# EAGLE design NCV7702B-2 (EAGLE 5.06)
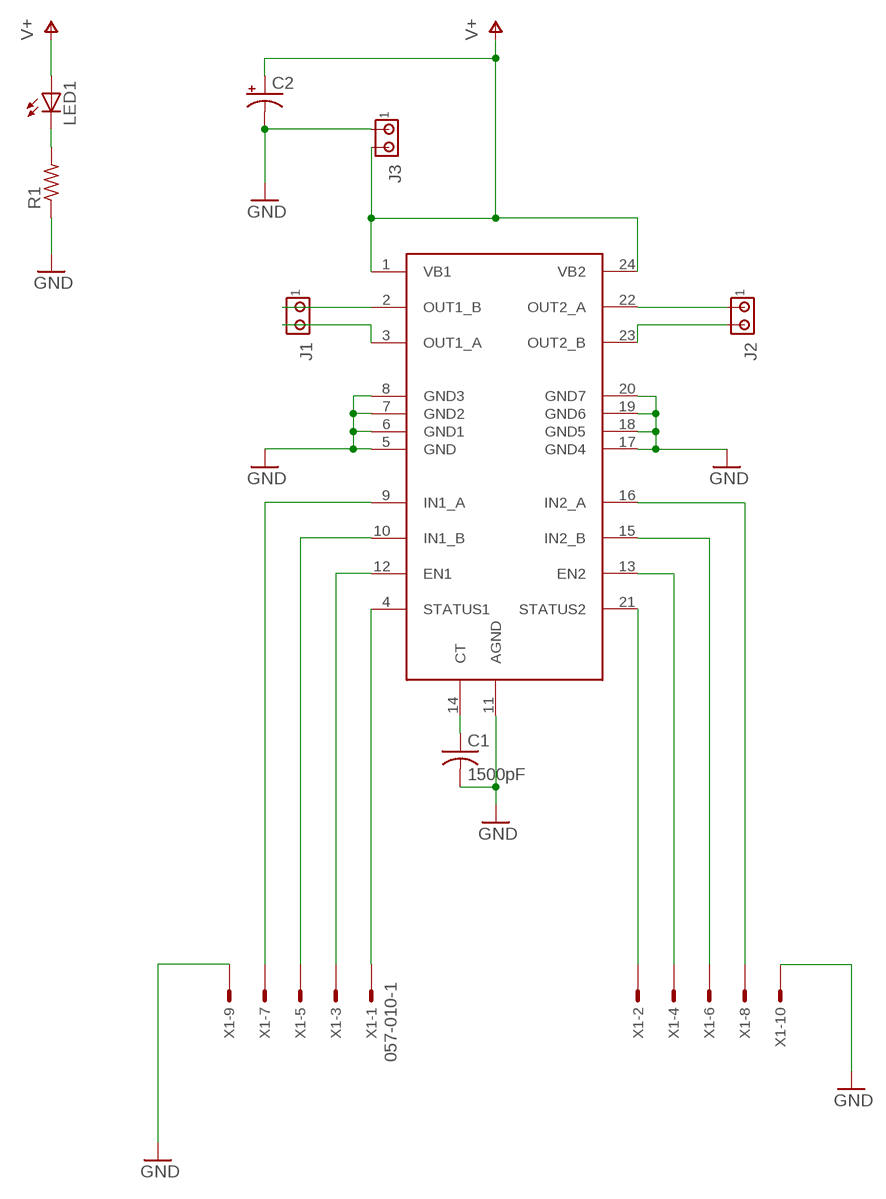
[diagram p0: schematic, sheet 1]

## Parts
C1  1500pF  C-US050-025X075  [C050-025X075]
C2  CPOL-USE5-10.5  [E5-10,5]
IC1  7702  [SO24W]
J1  MTA02-156  [1X2MTA]
J2  MTA02-156  [1X2MTA]
J3  MTA02-156  [1X2MTA]
LED1  LEDSMT1206  [1206]
R1  R-US_M1206  [M1206]
X1  057-010-1  [057-010-1]

## Nets
GND: C1.2 C2.- IC1.5(GND) IC1.6(GND1) IC1.7(GND2) IC1.8(GND3) IC1.11(AGND) IC1.17(GND4) IC1.18(GND5) IC1.19(GND6) IC1.20(GND7) J3.1 R1.1 X1.9 X1.10
N$1: IC1.2(OUT1_B) J1.1
N$2: IC1.10(IN1_B) X1.5
N$3: IC1.9(IN1_A) X1.7
N$4: IC1.13(EN2) X1.4
N$5: IC1.15(IN2_B) X1.6
N$6: IC1.3(OUT1_A) J1.2
N$7: IC1.22(OUT2_A) J2.1
N$8: IC1.23(OUT2_B) J2.2
N$9: IC1.16(IN2_A) X1.8
N$10: LED1.C R1.2
N$11: IC1.12(EN1) X1.3
N$12: IC1.4(STATUS1) X1.1
N$15: IC1.21(STATUS2) X1.2
N$17: C1.1 IC1.14(CT)
V+: C2.+ IC1.1(VB1) IC1.24(VB2) J3.2 LED1.A

## Library data of the parts
C1 = rcl:C-US: CAPACITOR, American symbol
C2 = rcl:CPOL-US: POLARIZED CAPACITOR, American symbol
IC1 = A-JD:7702
J1-J3 = con-amp:MTA02-156: AMP connector
LED1 = led:LED: LED OSRAM: - CHIPLED LG R971, LG N971, LY N971, LG Q971, LY Q971, LO R971, LY R971 LH N974, LH R974 LS Q976, LO Q976, LY Q976 LO Q996 - Hyper CHIPLED LW Q18S LB Q993, LB Q99A, LB R99A - SideLED LS A670, LO A670, LY A670, LG A670, LP A670 LB A673, LV A673, LT A673, LW A673 LH A674 LY A675 LS A676, LA A676, LO A676, LY A676, LW A676 LS A679, LY A679, LG A679 - Hyper Micro SIDELED® LS Y876, LA Y876, LO Y876, LY Y876 LT Y87S - SmartLED LW L88C, LW L88S LB L89C, LB L89S, LG L890 LS L89K, LO L89K, LY L89K LS L896, LA L896, LO L896, LY L896 - TOPLED LS T670, LO T670, LY T670, LG T670, LP T670 LSG T670, LSP T670, LSY T670, LOP T670, LYG T670 LG T671, LOG T671, LSG T671 LB T673, LV T673, LT T673, LW T673 LH T674 LS T676, LA T676, LO T676, LY T676, LB T676, LH T676, LSB T676, LW T676 LB T67C, LV T67C, LT T67C, LS T67K, LO T67K, LY T67K, LW E67C LS E67B, LA E67B, LO E67B, LY E67B, LB E67C, LV E67C, LT E67C LW T67C LS T679, LY T679, LG T679 LS T770, LO T770, LY T770, LG T770, LP T770 LB T773, LV T773, LT T773, LW T773 LH T774 LS E675, LA E675, LY E675, LS T675 LS T776, LA T776, LO T776, LY T776, LB T776 LHGB T686 LT T68C, LB T68C - Hyper Mini TOPLED® LB M676 - Mini TOPLED Santana® LG M470 LS M47K, LO M47K, LY M47K Source: http://www.osram.convergy.de LUXEON: - LUMILED® LXK2-PW12-R00, LXK2-PW12-S00, LXK2-PW14-U00, LXK2-PW14-V00 LXK2-PM12-R00, LXK2-PM12-S00, LXK2-PM14-U00 LXK2-PE12-Q00, LXK2-PE12-R00, LXK2-PE12-S00, LXK2-PE14-T00, LXK2-PE14-U00 LXK2-PB12-K00, LXK2-PB12-L00, LXK2-PB12-M00, LXK2-PB14-N00, LXK2-PB14-P00, LXK2-PB14-Q00 LXK2-PR12-L00, LXK2-PR12-M00, LXK2-PR14-Q00, LXK2-PR14-R00 LXK2-PD12-Q00, LXK2-PD12-R00, LXK2-PD12-S00 LXK2-PH12-R00, LXK2-PH12-S00 LXK2-PL12-P00, LXK2-PL12-Q00, LXK2-PL12-R00 Source: www.luxeon.com KINGBRIGHT: KA-3528ASYC Source: www.kingbright.com
R1 = resistor:R-US_: RESISTOR, American symbol
X1 = con-panduit:057-010-: CONNECTOR 10-pin series 057 contact pc board low profile headers

## Board
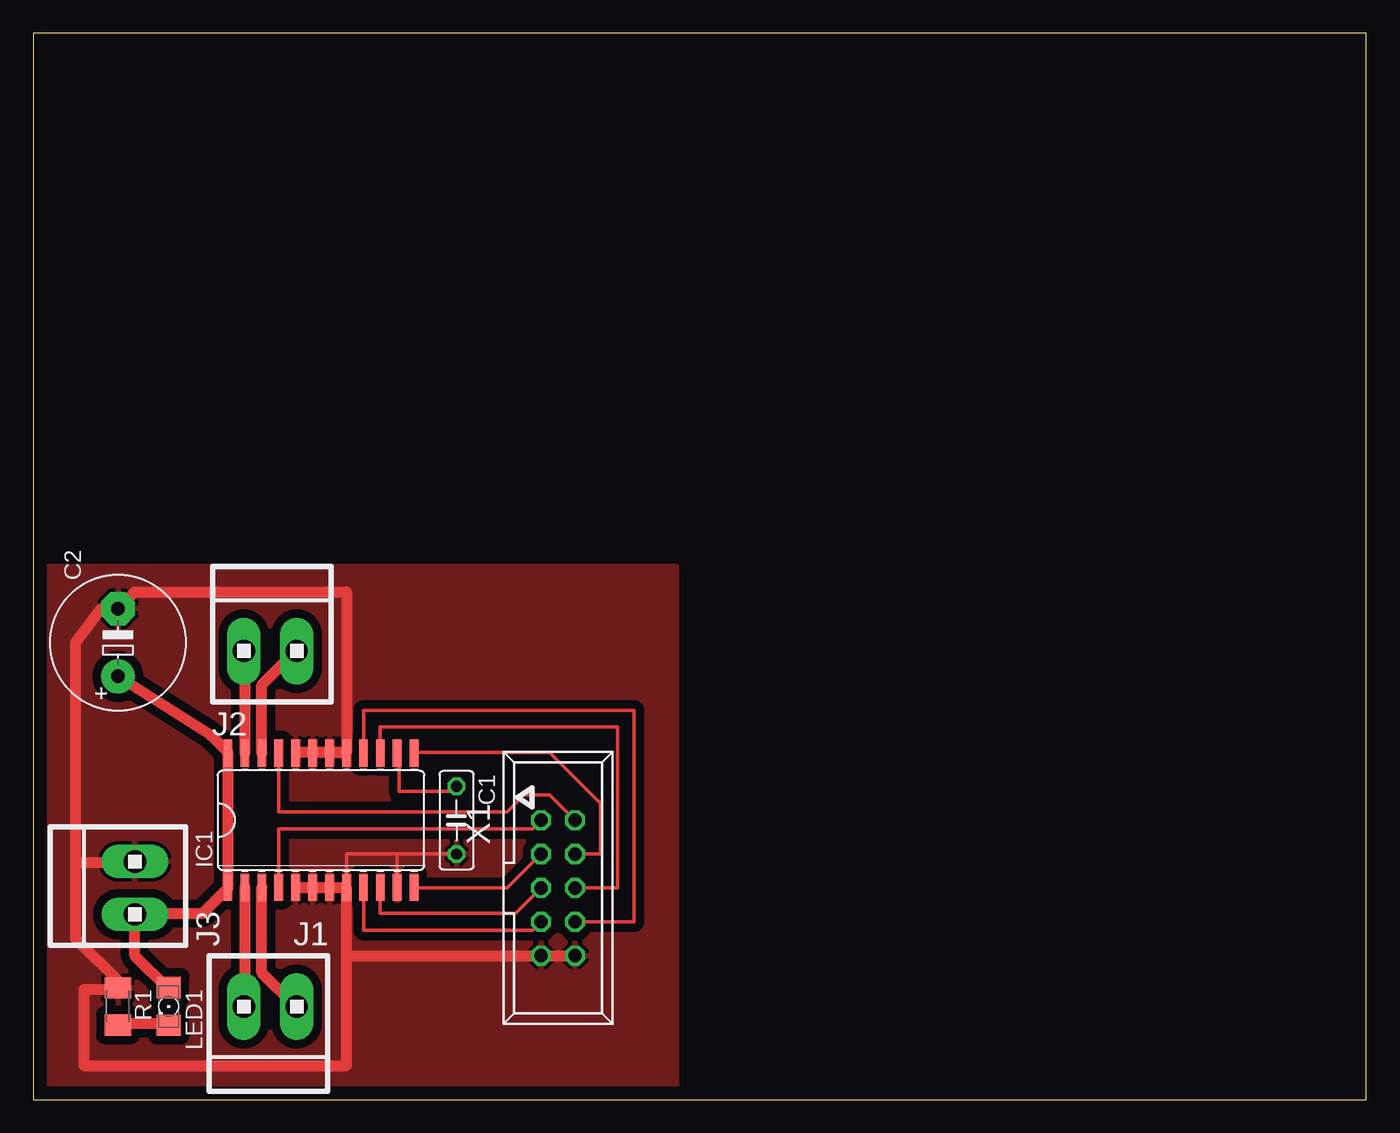
[diagram p1: board, top side]

Size 100 x 80 mm. Coordinates in mm from the lower left corner, seen from the top.
Outline: 0,0 100,0 100,80 0,80 0,0
Copper layers (1*16): Top 0.035mm / dielectric 1.5mm / Bottom 0.035mm
Design rules "default *": minimum track width 10mil, minimum drill 24mil, track to track 25mil, track to pad 25mil, pad to pad 8mil, via to via 8mil, smd to smd 8mil, copper to edge 40mil, drill to drill 8mil, minimum pad ring 10mil, minimum via ring 8mil, stop-mask expansion 4mil, vias tented up to drill 0mil, thermal gap 10mil

### Footprints (pad centres in the part's own frame; a part is rotated, then mirrored left to right if it is on the bottom)
C050-025X075 = drill 0.813 octagon: 1 -2.54,0; 2 2.54,0
E5-10,5 = drill 1.016 pad 2.54 round: + -2.54,0 | drill 1.016 pad 2.54 octagon: - 2.54,0
SO24W = smd 0.66 x 2.032: 1 -6.985,-5.029; 2 -5.715,-5.029; 3 -4.445,-5.029; 4 -3.175,-5.029; 5 -1.905,-5.029; 6 -0.635,-5.029; 7 0.635,-5.029; 8 1.905,-5.029; 9 3.175,-5.029; 10 4.445,-5.029; 11 5.715,-5.029; 12 6.985,-5.029; 13 6.985,5.029; 14 5.715,5.029; 15 4.445,5.029; 16 3.175,5.029; 17 1.905,5.029; 18 0.635,5.029; 19 -0.635,5.029; 20 -1.905,5.029; 21 -3.175,5.029; 22 -4.445,5.029; 23 -5.715,5.029; 24 -6.985,5.029
1X2MTA = drill 1.676 long: 1 1.981,0; 2 -1.981,0
1206 = smd 1.6 x 1.803: A -1.422,0; C 1.422,0
M1206 = smd 1.6 x 2: 1 -1.4,0; 2 1.4,0
057-010-1 = drill 1 octagon: 1 -5.08,-1.27; 2 -5.08,1.27; 3 -2.54,-1.27; 4 -2.54,1.27; 5 0,-1.27; 6 0,1.27; 7 2.54,-1.27; 8 2.54,1.27; 9 5.08,-1.27; 10 5.08,1.27

### Placement (x,y rotation side)
C1  31.75,20.95 270 top
C2  6.35,34.29 90 top
IC1  21.59,20.95 0 top
J1  17.78,6.99 180 top
J2  17.78,33.66 0 top
J3  7.62,15.88 90 top
LED1  10.16,6.99 270 top
R1  6.35,6.99 270 top
X1  39.37,15.88 270 top

### Tracks (layer width: path | path; a pad name or v marks a point on that pad's centre or on a via)
GND
  Top 0.254: 39.37,10.79 X1.9 | 19.81,26.04 IC1.20 19.81,25.78 | 20.83,26.04 IC1.19 21.08,26.04 | 23.37,26.04 IC1.17 | 21.59,26.04 22.1,26.04 IC1.18 | 19.81,15.88 IC1.5 19.81,16.13 | IC1.6 20.83,15.88 | IC1.7 22.35,15.88 23.37,15.88 IC1.8 23.5,17.14 | 22.1,15.88 23.5,15.88 23.5,17.14 | 27.3,18.41 C1.2 23.5,18.41 | 23.5,18.41 27.3,18.41 | 27.3,18.41 IC1.11 | 23.5,17.14 23.5,18.41 | 6.35,8.89 R1.1 6.35,8.26 | 7.62,17.78 J3.1
  Top 0.813: X1.10 39.37,10.79 23.5,10.79 | 20.83,26.04 19.81,26.04 | 23.37,26.04 22.35,26.04 IC1.18 | 21.08,26.04 21.59,26.04 23.5,26.04 23.5,38.1 7.62,38.1 C2.- 5.08,36.83 3.17,34.29 3.17,17.78 | 20.83,15.88 19.81,15.88 | IC1.6 21.08,15.88 23.5,15.88 23.5,10.79 | 22.1,15.88 IC1.7 | 6.35,8.89 3.17,12.06 3.17,17.78 | 3.17,17.78 7.62,17.78 | 23.5,10.79 23.5,2.54 3.81,2.54 3.81,8.26 6.35,8.26
  pour Top: 0.64,40.01 48.26,40.01 48.26,0.64 0.64,0.64
N$1
  Top 0.254: J1.1 15.88,6.99
  Top 0.813: 15.88,6.99 IC1.2
N$2
  Top 0.254: IC1.10 26.04,13.97 36.2,13.97 X1.5
N$3
  Top 0.254: IC1.9 24.77,12.7 37.47,12.7 X1.7
N$4
  Top 0.254: X1.4 42.55,18.41 42.55,22.23 38.73,26.04 28.57,26.04 IC1.13 28.57,25.4
N$5
  Top 0.254: X1.6 43.81,15.88 43.81,27.94 26.04,27.94 IC1.15
N$6
  Top 0.254: J1.2 19.68,6.99
  Top 0.813: 19.68,6.99 17.14,9.53 IC1.3
N$7
  Top 0.254: 19.68,33.66 J2.1
  Top 0.813: 19.68,33.66 17.14,31.11 IC1.22
N$8
  Top 0.254: 15.88,33.66 J2.2
  Top 0.813: IC1.23 15.88,33.66
N$9
  Top 0.254: X1.8 45.09,13.34 45.09,29.21 24.77,29.21 IC1.16
N$10
  Top 0.254: 10.16,5.71 LED1.C | R1.2 6.35,5.71
  Top 0.813: 6.35,5.71 10.16,5.71
N$11
  Top 0.254: X1.3 35.56,15.88 28.57,15.88 IC1.12 28.57,16.51
N$12
  Top 0.254: X1.1 37.47,20.32 18.41,20.32 IC1.4
N$15
  Top 0.254: X1.2 38.73,22.86 36.83,22.86 35.56,21.59 18.41,21.59 IC1.21
N$17
  Top 0.254: IC1.14 27.43,25.53 27.43,23.11 31.24,23.11 C1.1
V+
  Top 0.254: LED1.A 10.16,8.26 | 14.61,15.88 IC1.1 | IC1.24 14.61,26.04
  Top 0.813: 10.16,8.26 7.62,10.79 J3.2 7.62,13.97 12.7,13.97 14.61,15.88 | 14.61,26.04 13.34,27.3 C2.+ | IC1.1 IC1.24